# EAGLE design super_micro (EAGLE 9.1.3)
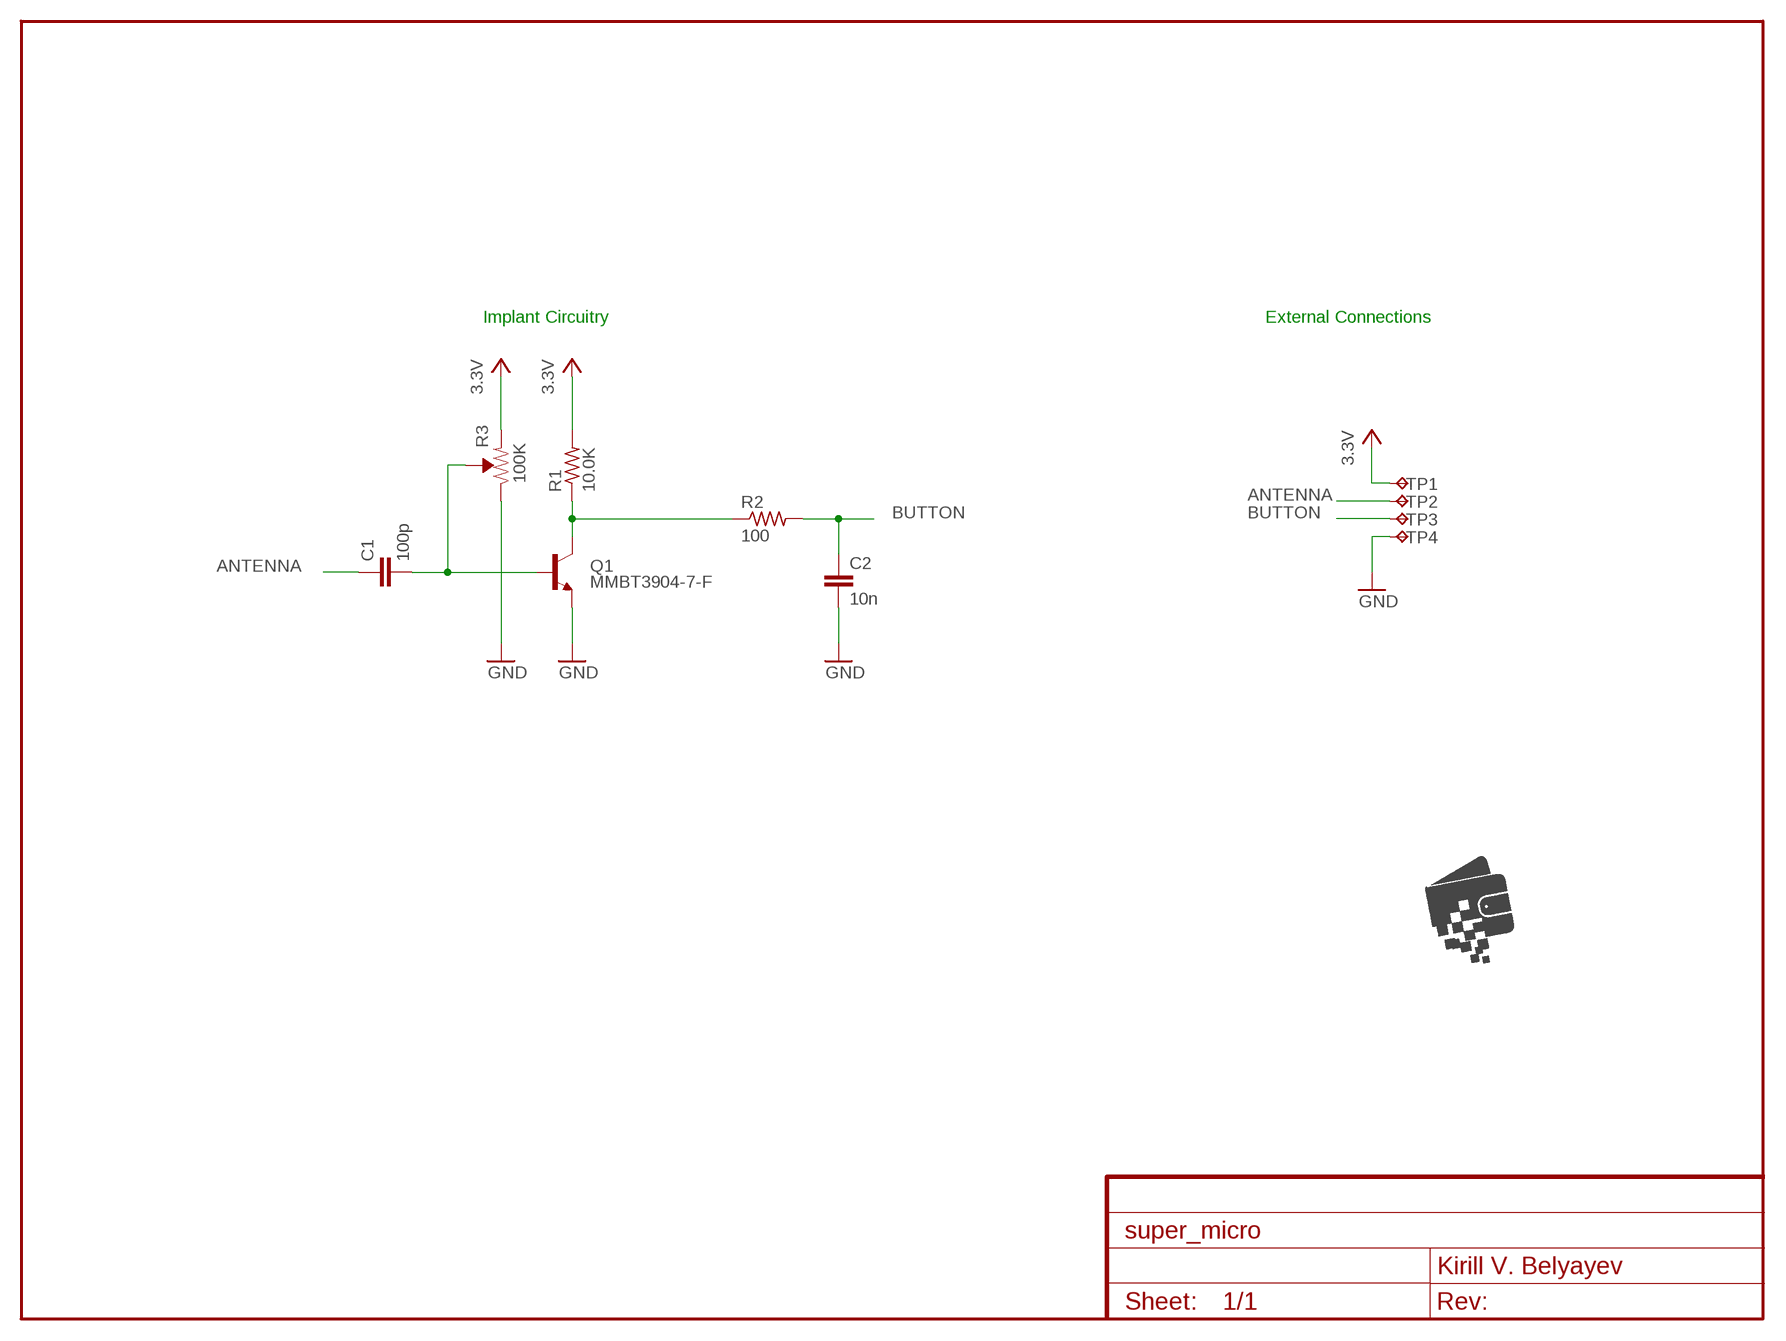
[diagram p0: schematic, sheet 1]
FRAME1 (FRAME-LETTER): CNAME: Super Micro Implant; CREVISION: A; DESIGNER: Kirill V. Belyayev

## Parts
C1  100p  C-EUC0603  [C0603]
C2  10n  C-EUC0603  [C0603]
LOGO1  WF_LOGO_S  [WF_LOGO_S]
Q1  MMBT3904-7-F  [SOT-23]
R1  10.0K  R-US_R0603  [R0603]
R2  100  R-US_R0603  [R0603]
R3  100K  3312J-1-104E  [3312J]
TP1  TEST-POINT40MIL  [TEST-POINT-40MILL]
TP2  TEST-POINT40MIL  [TEST-POINT-40MILL]
TP3  TEST-POINT40MIL  [TEST-POINT-40MILL]
TP4  TEST-POINT40MIL  [TEST-POINT-40MILL]

## Nets
0V: C2.2 Q1.2(E) R3.1 TP4.1(PP) ; supply symbol labelled GND
3.3V: R1.2 R3.3 TP1.1(PP)
ANTENNA: C1.1 TP2.1(PP)
BUTTON: C2.1 R2.2 TP3.1(PP)
N$1: Q1.3(C) R1.1 R2.1
N$3: C1.2 Q1.1(B) R3.2

## Notes on the sheet
- Implant Circuitry | External Connections

## Library data of the parts
C1 C2 = rcl:C-EU: CAPACITOR, European symbol; SPICEPREFIX: C
LOGO1 = KVB-misc:WF_LOGO: Wallet Fail Logo
Q1 = KVB-transistors:MMBT3904-7-F: TRANS NPN 40V 0.2A SMD SOT23-3; MAN-PART_NUM: MMBT3904-7-F; MANUFACTURER: Diodes Inc.
R1 R2 = rcl:R-US_: RESISTOR, American symbol; SPICEPREFIX: R
R3 = KVB-resistors:3312J-1-104E: 100 kOhms 0.1W, 1/10W J Lead Surface Mount Trimmer Potentiometer Cermet 1 Turn Top Adjustment; MAN-PART_NUM: 3312J-1-104E; MANUFACTURER: Bourns Inc.
TP1-TP4 = KVB-misc:TEST-POINT: Various Test Points

## Board
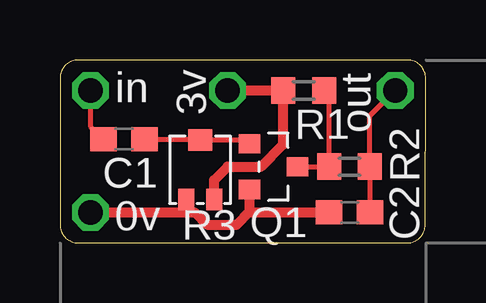
[diagram p1: board, top side]
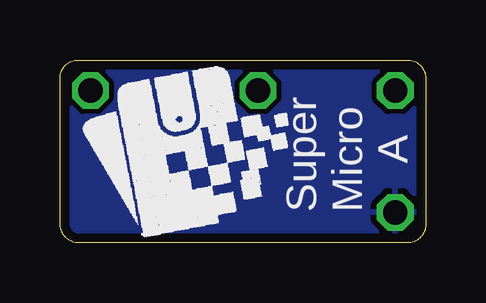
[diagram p2: board, bottom side, seen from below]

Size 15.24 x 7.62 mm. Coordinates in mm from the lower left corner, seen from the top.
Outline: 0,6.86 0,0.76 arc90 0.76,0 14.46,0 arc90 15.22,0.76 15.24,6.86 arc90 14.48,7.62 0.76,7.62 arc90 0,6.86
Copper layers (1*16): Top 0.035mm / dielectric 1.5mm / Bottom 0.035mm
Design rules "KVB-2layer": minimum track width 6mil, minimum drill 15mil, track to track 8mil, track to pad 8mil, pad to pad 8mil, via to via 8mil, smd to smd 8mil, copper to edge 15mil, drill to drill 8mil, minimum pad ring 10mil, minimum via ring 8mil, stop-mask expansion 3mil, vias tented up to drill 0mil, thermal gap 10mil

### Footprints (pad centres in the part's own frame; a part is rotated, then mirrored left to right if it is on the bottom)
C0603 = smd 1.1 x 1: 1 -0.85,0; 2 0.85,0
SOT-23 = smd 0.8 x 0.9: 1 -0.95,-1; 2 0.95,-1; 3 0,1
R0603 = smd 1 x 1.1: 1 -0.85,0; 2 0.85,0
3312J = smd 0.66 x 0.889: 1 -0.584,-1.245; 3 0.584,-1.245 | smd 0.991 x 0.889: 2 0,1.245
TEST-POINT-40MILL = drill 1.016 pad 1.524 octagon: 1 0,0

### Placement (x,y rotation side)
C1  2.67,4.32 0 top
C2  12.06,1.27 180 top
LOGO1  5.71,0.25 90 bottom
Q1  8.89,3.17 270 top
R1  10.16,6.35 180 top
R2  12.06,3.17 0 top
R3  5.84,3.05 0 top
TP1  6.99,6.35 0 top
TP2  1.27,6.35 0 top
TP3  13.97,6.35 0 top
TP4  1.27,1.27 180 top

### Tracks (layer width: path | path; a pad name or v marks a point on that pad's centre or on a via)
0V
  Top 0.406: 7.87,1.27 C2.2 | Q1.2 7.89,1.29 arc-90 7.87,1.27 | TP4.1 5.21,1.27 | 5.21,1.27 5.26,1.32 R3.1 | 7.87,1.27 7.37,0.76 6.12,0.76 5.61,1.27 5.21,1.27 | 5.56,1.27 5.21,1.27
  pour Bottom: 0,7.62 0,0 15.24,0 15.24,7.62
3.3V
  Top 0.406: 6.71,6.07 TP1.1 R1.2 9.31,4.1 8.38,3.17 6.99,3.17 6.43,2.62 R3.3
ANTENNA
  Top 0.203: TP2.1 1.27,4.87 C1.1
BUTTON
  Top 0.203: C2.1 R2.2 12.91,5.29 TP3.1
N$1
  Top 0.203: Q1.3 R2.1 11.21,6.14 R1.1
N$3
  Top 0.203: C1.2 5.82,4.32 R3.2 7.72,4.29 Q1.1

### Text on the board
tPlace: in | 3v | out | 0v
bPlace: A | Super / Micro